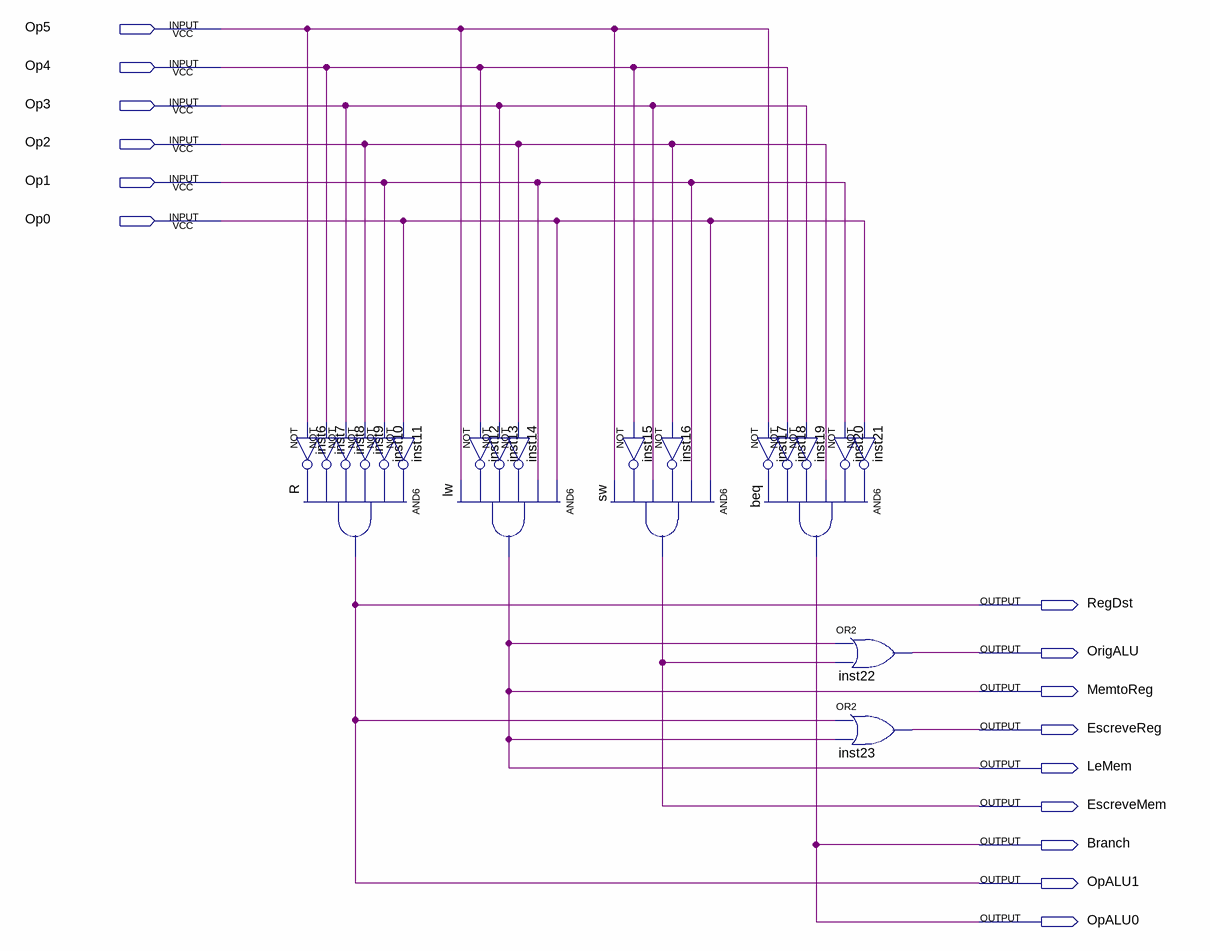
[diagram p0: schematic sheet]
// Quartus schematic controlePLA.bdf as structural Verilog: 22 symbols, 15 pins
module controlePLA (
  input  Op5,
  input  Op4,
  input  Op3,
  input  Op2,
  input  Op1,
  input  Op0,
  output RegDst,
  output OrigALU,
  output MemtoReg,
  output EscreveReg,
  output LeMem,
  output EscreveMem,
  output Branch,
  output OpALU1,
  output OpALU0
);

  wire inst6_out, inst7_out, inst8_out, inst9_out, inst10_out, inst11_out, inst12_out, inst13_out,
       inst14_out, inst15_out, inst16_out, inst17_out, inst18_out, inst19_out, inst20_out, inst21_out;

  not inst6 (inst6_out, Op5);
  not inst7 (inst7_out, Op4);
  not inst8 (inst8_out, Op3);
  and R (OpALU1, inst11_out, inst10_out, inst9_out, inst8_out, inst7_out, inst6_out);
  not inst9 (inst9_out, Op2);
  not inst10 (inst10_out, Op1);
  not inst11 (inst11_out, Op0);
  not inst12 (inst12_out, Op4);
  not inst13 (inst13_out, Op3);
  and lw (LeMem, Op0, Op1, inst14_out, inst13_out, inst12_out, Op5);
  not inst14 (inst14_out, Op2);
  not inst15 (inst15_out, Op4);
  and sw (EscreveMem, Op0, Op1, inst16_out, Op3, inst15_out, Op5);
  not inst16 (inst16_out, Op2);
  not inst17 (inst17_out, Op5);
  not inst18 (inst18_out, Op4);
  not inst19 (inst19_out, Op3);
  and beq (Branch, inst21_out, inst20_out, Op2, inst19_out, inst18_out, inst17_out);
  not inst20 (inst20_out, Op1);
  not inst21 (inst21_out, Op0);
  or inst22 (OrigALU, LeMem, EscreveMem);
  or inst23 (EscreveReg, OpALU1, LeMem);

  assign MemtoReg = LeMem;
  assign OpALU0 = Branch;
  assign RegDst = OpALU1;
endmodule
